# EAGLE design IMU Board (EAGLE 8.3.0)
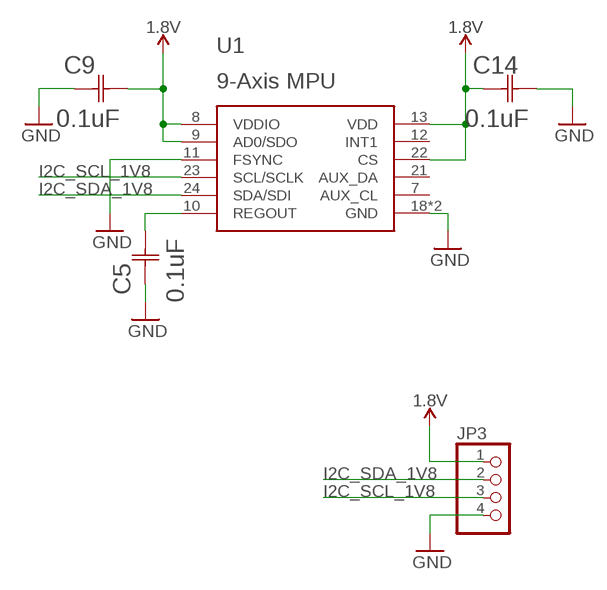
[diagram p0: schematic, sheet 1]

## Parts
C5  0.1uF  08055C104KAT2A  [0805]
C9  0.1uF  08055C104KAT2A  [0805]
C14  0.1uF  08055C104KAT2A  [0805]
JP3  PINHD-1X4  [1X04]
U1  ICM-20948  [QFN40P300X300X105-25N]

## Nets
1.8V: C9.2 C14.1 JP3.1 U1.8(VDDIO) U1.9(AD0/SDO) U1.13(VDD) U1.22(CS)
GND: C5.1 C9.1 C14.2 JP3.4 U1.11(FSYNC) U1.18(GND) U1.20(GND)
I2C_SCL_1V8: JP3.3 U1.23(SCL/SCLK)
I2C_SDA_1V8: JP3.2 U1.24(SDA/SDI)
N$11: C5.2 U1.10(REGOUT)
Unconnected: U1.7(AUX_CL) U1.12(INT1) U1.21(AUX_DA)

## Library data of the parts
C5 C9 C14 = 0.1uF X7R Ceramic Capacitor:08055C104KAT2A; COPYRIGHT: Copyright C 2015 Accelerated Designs. All rights reserved; MANUFACTURER_PART_NUMBER: 08055C104KAT2A; VENDOR: Vendor
JP3 = pinhead:PINHD-1X4: PIN HEADER
U1 = ICM-20948-mpu:ICM-20948

## Board
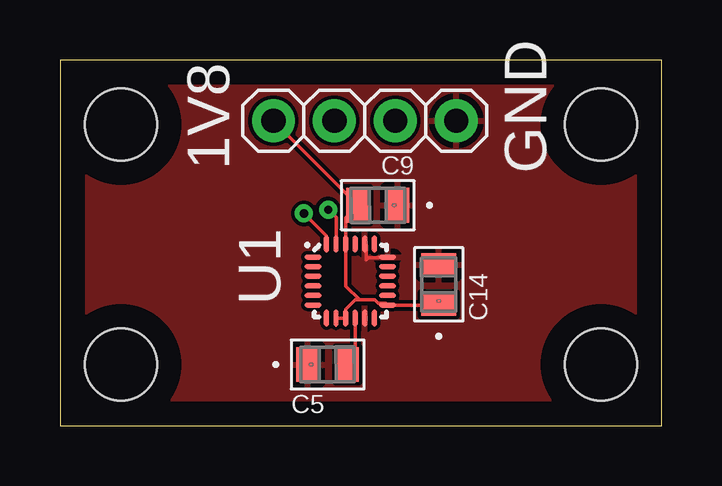
[diagram p1: board, top side]
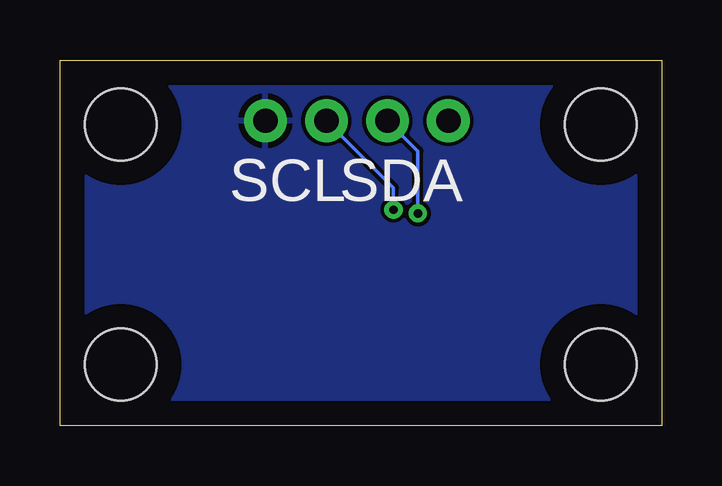
[diagram p2: board, bottom side, seen from below]

Size 25.07 x 15.23 mm. Coordinates in mm from the lower left corner, seen from the top.
Outline: 0,0 25.07,0 25.07,15.23 0,15.23 0,0
Copper layers (1*16): Top 0.035mm / dielectric 1.5mm / Bottom 0.035mm
Design rules "default": minimum track width 6mil, minimum drill 0.35mm, track to track 6mil, track to pad 6mil, pad to pad 6mil, via to via 6mil, smd to smd 6mil, copper to edge 40mil, drill to drill 6mil, minimum pad ring 10mil, minimum via ring 8mil, stop-mask expansion 4mil, vias tented up to drill 0mil, thermal gap 10mil
Holes 3 mm at 2.54,12.54 2.54,2.54 22.54,12.54 22.54,2.54

### Footprints (pad centres in the part's own frame; a part is rotated, then mirrored left to right if it is on the bottom)
0805 = smd 0.965 x 1.448: 1 -0.826,0; 2 0.826,0
1X04 = drill 1.016 pad 1.778: 1 -3.81,0; 2 -1.27,0; 3 1.27,0; 4 3.81,0
QFN40P300X300X105-25N = smd 0.7 x 0.2: 1 -1.55,1; 2 -1.55,0.6; 3 -1.55,0.2; 4 -1.55,-0.2; 5 -1.55,-0.6; 6 -1.55,-1; 13 1.55,-1; 14 1.55,-0.6; 15 1.55,-0.2; 16 1.55,0.2; 17 1.55,0.6; 18 1.55,1 | smd 0.2 x 0.7: 7 -1,-1.55; 8 -0.6,-1.55; 9 -0.2,-1.55; 10 0.2,-1.55; 11 0.6,-1.55; 12 1,-1.55; 19 1,1.55; 20 0.6,1.55; 21 0.2,1.55; 22 -0.2,1.55; 23 -0.6,1.55; 24 -1,1.55

### Placement (x,y rotation side)
C5  11.15,2.54 0 top
C9  13.24,9.18 180 top
C14  15.78,5.88 90 top
JP3  12.7,12.7 0 top
U1  12.1,6.02 0 top

### Tracks (layer width: path | path; a pad name or v marks a point on that pad's centre or on a via)
1.8V
  Top 0.152: JP3.1 C9.2 11.9,8.66 U1.22 11.9,5.81 12.48,5.23 | C14.1 15.74,5.02 U1.13 13.58,5.09 13.26,5.09 13.12,5.23 12.48,5.23 | U1.8 U1.9 11.9,4.84 12.29,5.23 12.48,5.23
GND
  Top 0.152: U1.18 13.27,7.02 13.24,6.99 12.83,6.99 12.75,6.91 12.75,7.52 U1.20
  pour Top: 0.2,15 25,15 25,0 0.2,0
  pour Bottom: 0,15.2 25,15.2 25,0 0,0
I2C_SCL_1V8  (via drill 0.35)
  Top 0.152: U1.23 11.5,8.67 v11.18,8.99
  Bottom 0.152: v11.18,8.99 11.18,9.91 JP3.3
I2C_SDA_1V8  (via drill 0.35)
  Top 0.152: U1.24 11.1,7.9 v10.16,8.84
  Bottom 0.152: v10.16,8.84 10.16,11.43 JP3.2
N$11
  Top 0.152: U1.10 12.3,2.87 C5.2

### Text on the board
tPlace: 1V8 | GND | U1
bPlace: SDA | SCL